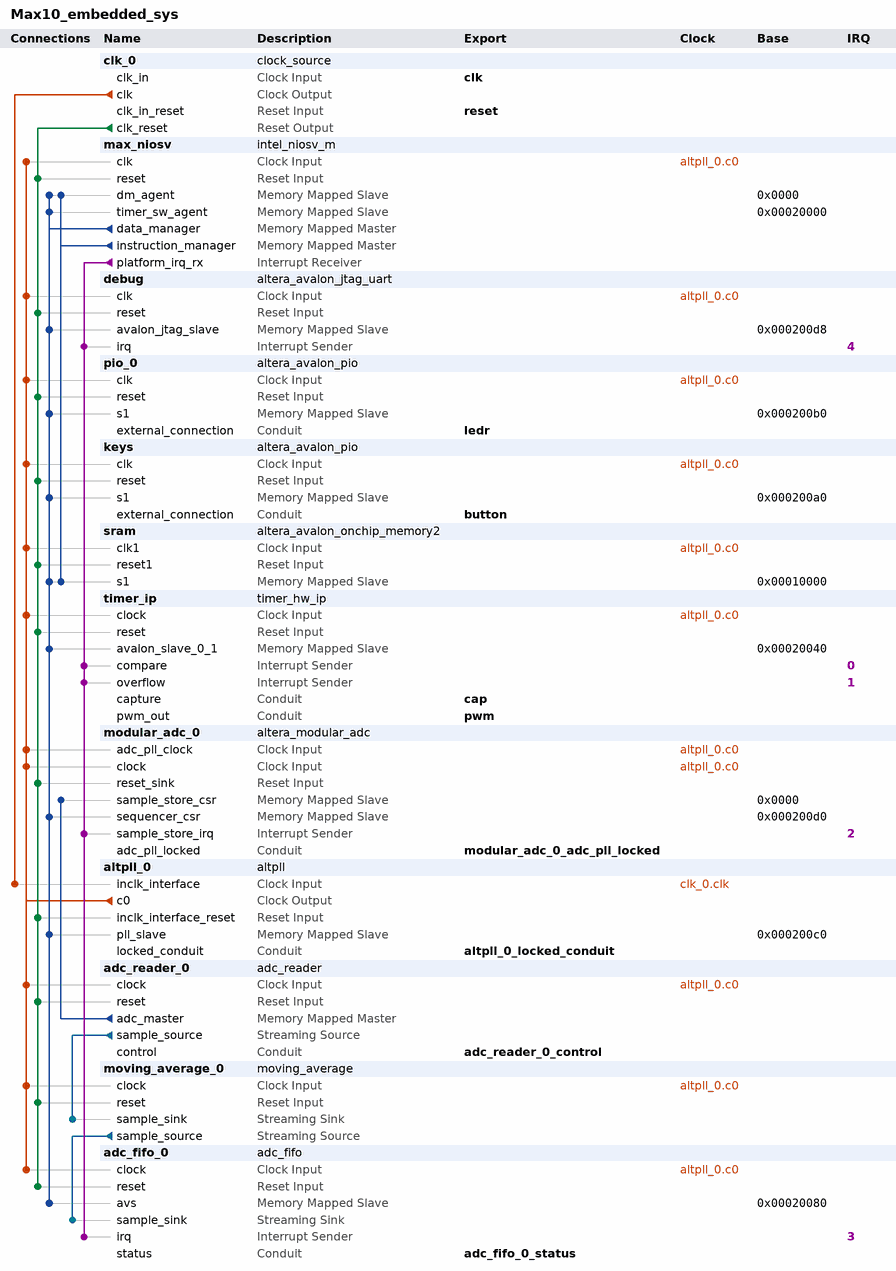
[diagram p0: system contents]
# Platform Designer (Qsys) system Max10_embedded_sys, MAX 10 10M50DAF484C7G
# Parameters at their usual value, and those the tool derives, are not listed.
package require -exact qsys 25.1
create_system Max10_embedded_sys
set_project_property DEVICE_FAMILY {MAX 10}
set_project_property DEVICE 10M50DAF484C7G

add_instance clk_0 clock_source 25.1
set_instance_parameter_value clk_0 clockFrequency 50000000

add_instance max_niosv intel_niosv_m 26.0.0
set_instance_parameter_value max_niosv clockFrequency 10000000
set_instance_parameter_value max_niosv enableAvalonInterface false
set_instance_parameter_value max_niosv enableDebugReset false
set_instance_parameter_value max_niosv enableECCFull false
set_instance_parameter_value max_niosv enableECCLite false
set_instance_parameter_value max_niosv hartId 0
set_instance_parameter_value max_niosv interruptMode 0
set_instance_parameter_value max_niosv pipelineArch true
set_instance_parameter_value max_niosv resetSlave sram.s1

add_instance debug altera_avalon_jtag_uart 25.1
set_instance_parameter_value debug simInteractiveOptions NO_INTERACTIVE_WINDOWS

add_instance pio_0 altera_avalon_pio 25.1
set_instance_parameter_value pio_0 direction Output
set_instance_parameter_value pio_0 width 10

add_instance keys altera_avalon_pio 25.1
set_instance_parameter_value keys direction Input
set_instance_parameter_value keys width 2

add_instance sram altera_avalon_onchip_memory2 25.1
set_instance_parameter_value sram dataWidth 32
set_instance_parameter_value sram dualPort false
set_instance_parameter_value sram initMemContent false
set_instance_parameter_value sram initializationFileName onchip_mem.hex
set_instance_parameter_value sram memorySize 40960

add_instance timer_ip timer_hw_ip 1.0

add_instance modular_adc_0 altera_modular_adc 25.1
set_instance_parameter_value modular_adc_0 CLOCK_FREQ 10000000
set_instance_parameter_value modular_adc_0 CORE_VAR 0
set_instance_parameter_value modular_adc_0 DEVICE_PART 10M50DAF484C7G
set_instance_parameter_value modular_adc_0 clkdiv 2
set_instance_parameter_value modular_adc_0 int_vref_vr 3.0
set_instance_parameter_value modular_adc_0 refsel 0
set_instance_parameter_value modular_adc_0 sample_rate 0
set_instance_parameter_value modular_adc_0 seq_order_length 1
set_instance_parameter_value modular_adc_0 seq_order_slot_1 0
set_instance_parameter_value modular_adc_0 seq_order_slot_2 30
set_instance_parameter_value modular_adc_0 seq_order_slot_3 30
set_instance_parameter_value modular_adc_0 seq_order_slot_4 30
set_instance_parameter_value modular_adc_0 seq_order_slot_5 30
set_instance_parameter_value modular_adc_0 seq_order_slot_6 30
set_instance_parameter_value modular_adc_0 seq_order_slot_7 30
set_instance_parameter_value modular_adc_0 use_ch0 true
set_instance_parameter_value modular_adc_0 use_ch1 false
set_instance_parameter_value modular_adc_0 use_ch2 false
set_instance_parameter_value modular_adc_0 use_ch3 false
set_instance_parameter_value modular_adc_0 use_ch4 false
set_instance_parameter_value modular_adc_0 use_ch5 false
set_instance_parameter_value modular_adc_0 use_ch6 false
set_instance_parameter_value modular_adc_0 use_ch7 false
set_instance_parameter_value modular_adc_0 use_ch8 false
set_instance_parameter_value modular_adc_0 use_tsd false

add_instance altpll_0 altpll 25.1
set_instance_parameter_value altpll_0 CLK0_DIVIDE_BY 5
set_instance_parameter_value altpll_0 CLK0_MULTIPLY_BY 1
set_instance_parameter_value altpll_0 INCLK0_INPUT_FREQUENCY 20000
set_instance_parameter_value altpll_0 PORT_ARESET PORT_UNUSED
set_instance_parameter_value altpll_0 PORT_LOCKED PORT_USED
set_instance_parameter_value altpll_0 PORT_clk1 PORT_UNUSED
set_instance_parameter_value altpll_0 PORT_clk2 PORT_UNUSED
set_instance_parameter_value altpll_0 PORT_clk3 PORT_UNUSED

add_instance adc_reader_0 adc_reader 1.0
set_instance_parameter_value adc_reader_0 SAMPLE_SLOTS 64

add_instance moving_average_0 moving_average 1.0
set_instance_parameter_value moving_average_0 ACC_W 20
set_instance_parameter_value moving_average_0 COEF_W 8
set_instance_parameter_value moving_average_0 DATA_W 12
set_instance_parameter_value moving_average_0 TAPS 16

add_instance adc_fifo_0 adc_fifo 1.0
set_instance_parameter_value adc_fifo_0 ALMOST_EMPTY_THRESHOLD 4
set_instance_parameter_value adc_fifo_0 ALMOST_FULL_THRESHOLD 768
set_instance_parameter_value adc_fifo_0 DATA_WIDTH 16
set_instance_parameter_value adc_fifo_0 FIFO_DEPTH 1024

# connections
add_connection altpll_0.c0 adc_fifo_0.clock clock
add_connection altpll_0.c0 adc_reader_0.clock clock
add_connection altpll_0.c0 debug.clk clock
add_connection altpll_0.c0 keys.clk clock
add_connection altpll_0.c0 max_niosv.clk clock
add_connection altpll_0.c0 modular_adc_0.adc_pll_clock clock
add_connection altpll_0.c0 modular_adc_0.clock clock
add_connection altpll_0.c0 moving_average_0.clock clock
add_connection altpll_0.c0 pio_0.clk clock
add_connection altpll_0.c0 sram.clk1 clock
add_connection altpll_0.c0 timer_ip.clock clock
add_connection clk_0.clk altpll_0.inclk_interface clock
add_connection clk_0.clk_reset adc_fifo_0.reset reset
add_connection clk_0.clk_reset adc_reader_0.reset reset
add_connection clk_0.clk_reset altpll_0.inclk_interface_reset reset
add_connection clk_0.clk_reset debug.reset reset
add_connection clk_0.clk_reset keys.reset reset
add_connection clk_0.clk_reset max_niosv.reset reset
add_connection clk_0.clk_reset modular_adc_0.reset_sink reset
add_connection clk_0.clk_reset moving_average_0.reset reset
add_connection clk_0.clk_reset pio_0.reset reset
add_connection clk_0.clk_reset sram.reset1 reset
add_connection clk_0.clk_reset timer_ip.reset reset
add_connection adc_reader_0.adc_master modular_adc_0.sample_store_csr avalon
set_connection_parameter_value adc_reader_0.adc_master/modular_adc_0.sample_store_csr baseAddress 0x0000
add_connection max_niosv.data_manager adc_fifo_0.avs avalon
set_connection_parameter_value max_niosv.data_manager/adc_fifo_0.avs baseAddress 0x00020080
add_connection max_niosv.data_manager altpll_0.pll_slave avalon
set_connection_parameter_value max_niosv.data_manager/altpll_0.pll_slave baseAddress 0x000200c0
add_connection max_niosv.data_manager debug.avalon_jtag_slave avalon
set_connection_parameter_value max_niosv.data_manager/debug.avalon_jtag_slave baseAddress 0x000200d8
add_connection max_niosv.data_manager keys.s1 avalon
set_connection_parameter_value max_niosv.data_manager/keys.s1 baseAddress 0x000200a0
add_connection max_niosv.data_manager max_niosv.dm_agent avalon
set_connection_parameter_value max_niosv.data_manager/max_niosv.dm_agent baseAddress 0x0000
add_connection max_niosv.data_manager max_niosv.timer_sw_agent avalon
set_connection_parameter_value max_niosv.data_manager/max_niosv.timer_sw_agent baseAddress 0x00020000
add_connection max_niosv.data_manager modular_adc_0.sequencer_csr avalon
set_connection_parameter_value max_niosv.data_manager/modular_adc_0.sequencer_csr baseAddress 0x000200d0
add_connection max_niosv.data_manager pio_0.s1 avalon
set_connection_parameter_value max_niosv.data_manager/pio_0.s1 baseAddress 0x000200b0
add_connection max_niosv.data_manager sram.s1 avalon
set_connection_parameter_value max_niosv.data_manager/sram.s1 baseAddress 0x00010000
add_connection max_niosv.data_manager timer_ip.avalon_slave_0_1 avalon
set_connection_parameter_value max_niosv.data_manager/timer_ip.avalon_slave_0_1 baseAddress 0x00020040
add_connection max_niosv.instruction_manager max_niosv.dm_agent avalon
set_connection_parameter_value max_niosv.instruction_manager/max_niosv.dm_agent baseAddress 0x0000
add_connection max_niosv.instruction_manager sram.s1 avalon
set_connection_parameter_value max_niosv.instruction_manager/sram.s1 baseAddress 0x00010000
add_connection adc_reader_0.sample_source moving_average_0.sample_sink avalon_streaming
add_connection moving_average_0.sample_source adc_fifo_0.sample_sink avalon_streaming
add_connection max_niosv.platform_irq_rx adc_fifo_0.irq interrupt
set_connection_parameter_value max_niosv.platform_irq_rx/adc_fifo_0.irq irqNumber 3
add_connection max_niosv.platform_irq_rx debug.irq interrupt
set_connection_parameter_value max_niosv.platform_irq_rx/debug.irq irqNumber 4
add_connection max_niosv.platform_irq_rx modular_adc_0.sample_store_irq interrupt
set_connection_parameter_value max_niosv.platform_irq_rx/modular_adc_0.sample_store_irq irqNumber 2
add_connection max_niosv.platform_irq_rx timer_ip.compare interrupt
set_connection_parameter_value max_niosv.platform_irq_rx/timer_ip.compare irqNumber 0
add_connection max_niosv.platform_irq_rx timer_ip.overflow interrupt
set_connection_parameter_value max_niosv.platform_irq_rx/timer_ip.overflow irqNumber 1

# exported interfaces
add_interface adc_fifo_0_status conduit end
set_interface_property adc_fifo_0_status EXPORT_OF adc_fifo_0.status
add_interface adc_reader_0_control conduit end
set_interface_property adc_reader_0_control EXPORT_OF adc_reader_0.control
add_interface altpll_0_locked_conduit conduit end
set_interface_property altpll_0_locked_conduit EXPORT_OF altpll_0.locked_conduit
add_interface button conduit end
set_interface_property button EXPORT_OF keys.external_connection
add_interface cap conduit end
set_interface_property cap EXPORT_OF timer_ip.capture
add_interface clk clock sink
set_interface_property clk EXPORT_OF clk_0.clk_in
add_interface ledr conduit end
set_interface_property ledr EXPORT_OF pio_0.external_connection
add_interface modular_adc_0_adc_pll_locked conduit end
set_interface_property modular_adc_0_adc_pll_locked EXPORT_OF modular_adc_0.adc_pll_locked
add_interface pwm conduit end
set_interface_property pwm EXPORT_OF timer_ip.pwm_out
add_interface reset reset sink
set_interface_property reset EXPORT_OF clk_0.clk_in_reset

set_interconnect_requirement {$system} qsys_mm.clockCrossingAdapter HANDSHAKE
set_interconnect_requirement {$system} qsys_mm.enableEccProtection FALSE
set_interconnect_requirement {$system} qsys_mm.insertDefaultSlave FALSE
set_interconnect_requirement {$system} qsys_mm.maxAdditionalLatency 1

save_system Max10_embedded_sys.qsys
